# EAGLE design MainBoard (EAGLE 6.2)
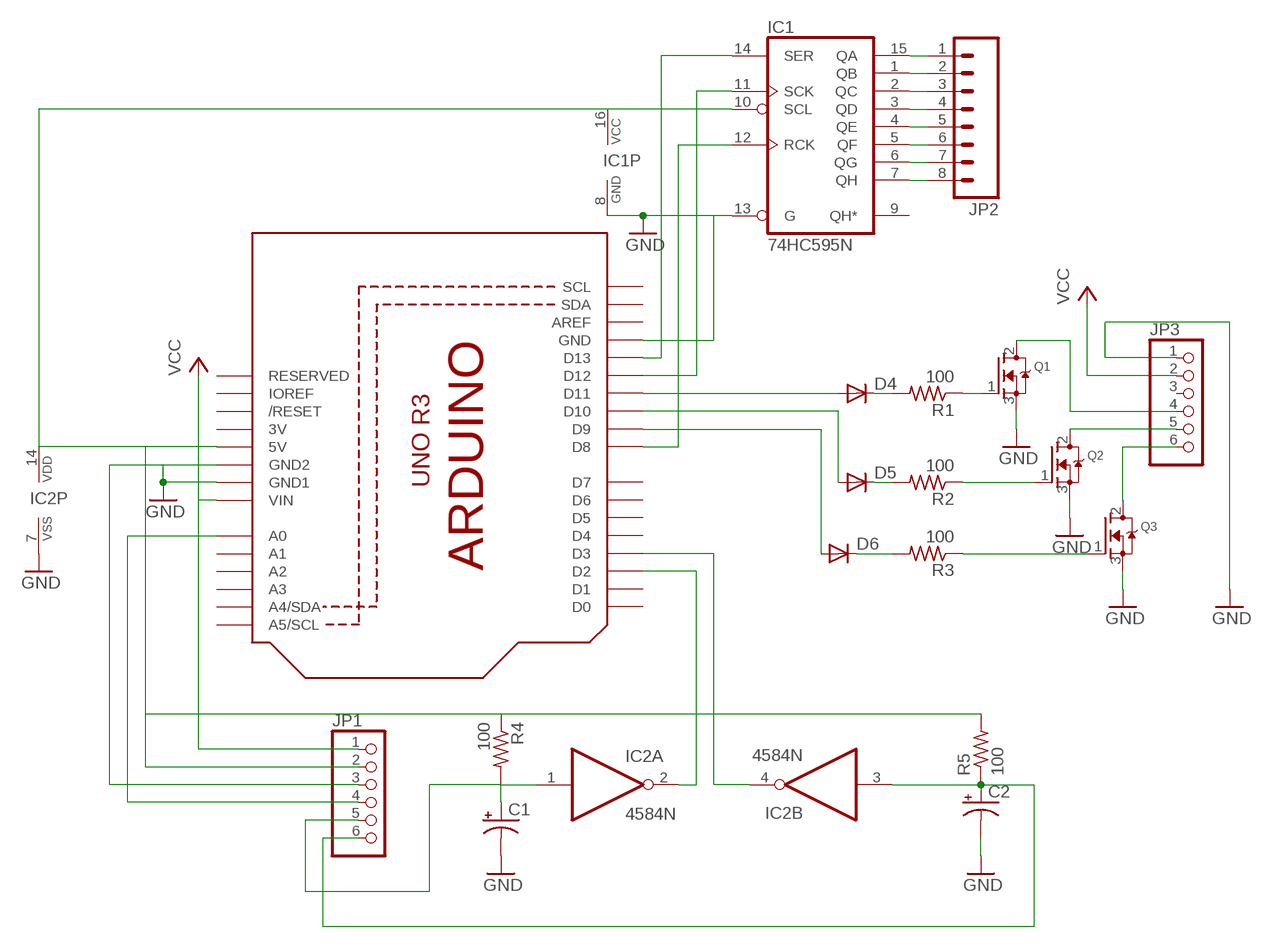
[diagram p0: schematic, sheet 1]

## Parts
C1  CPOL-USE2.5-5  [E2,5-5]
C2  CPOL-USE2.5-5  [E2,5-5]
D4  1N4148DO35-7  [DO35-7]
D5  1N4148DO35-7  [DO35-7]
D6  1N4148DO35-7  [DO35-7]
IC1  74HC595N  [DIL16]
IC2  4584N  [DIL14]
JP1  PINHD-1X6LOCK  [1X06-BIGLOCK]
JP2  M08LOCK  [1X08_LOCK]
JP3  PINHD-1X6LOCK  [1X06-BIGLOCK]
Q1  MOSFET-NGDS_TO220V  [TO220V]
Q2  MOSFET-NGDS_TO220V  [TO220V]
Q3  MOSFET-NGDS_TO220V  [TO220V]
R1  100  R-US_0207/10  [0207/10]
R2  100  R-US_0207/10  [0207/10]
R3  100  R-US_0207/10  [0207/10]
R4  100  R-US_0207/10  [0207/10]
R5  100  R-US_0207/10  [0207/10]
U1  ARDUINOR3-BPLACE  [ARDUINOR3-BPLACE]

## Nets
5V: IC1.10(SCL) IC1.16(VCC) IC2.14(P:VDD) JP1.2 R4.1 R5.2 U1.5V
12V: JP1.1 JP3.2 U1.VIN ; supply symbol labelled VCC
BLUE: JP3.6 Q3.2(D)
GND: C1.- C2.- IC1.8(GND) IC1.13(G) IC2.7(P:VSS) JP1.3 JP3.1 Q1.3(S) Q2.3(S) Q3.3(S) U1.GND U1.GND1 U1.GND2
GREEN: JP3.4 Q1.2(D)
N$1: D6.A U1.D9
N$2: D5.A U1.D10
N$3: D4.C R1.2
N$6: IC2.4(B:O) U1.D3
N$9: IC2.2(A:O) U1.D2
N$11: D5.C R2.2
N$12: D6.C R3.2
N$14: D4.A U1.D11
N$15: IC1.1(QB) JP2.2
N$16: IC1.2(QC) JP2.3
N$17: IC1.3(QD) JP2.4
N$18: IC1.4(QE) JP2.5
N$19: IC1.5(QF) JP2.6
N$20: IC1.6(QG) JP2.7
N$21: IC1.7(QH) JP2.8
N$22: IC1.15(QA) JP2.1
N$23: IC1.12(RCK) U1.D8
N$24: IC1.11(SCK) U1.D12
N$25: IC1.14(SER) U1.D13
N$26: Q3.1(G) R3.1
N$27: Q2.1(G) R2.1
N$29: Q1.1(G) R1.1
RED: JP3.5 Q2.2(D)
SPEED: JP1.4 U1.A0
SWITCH1: C1.+ IC2.1(A:I) JP1.5 R4.2
SWITCH2: C2.+ IC2.3(B:I) JP1.6 R5.1
Unconnected: IC1.9(QH*) IC2.5(C:I) IC2.6(C:O) IC2.8(D:O) IC2.9(D:I) IC2.10(E:O) IC2.11(E:I) IC2.12(F:O) IC2.13(F:I) JP3.3 U1.A1 U1.A2 U1.A3 U1.A4(A4/SDA) U1.A5(A5/SCL) U1.AREF U1.D0 U1.D1 U1.D4 U1.D5 U1.D6 U1.D7 U1.IOREF U1.RESERVED U1.RESET(/RESET) U1.SCL U1.SDA

## Power pins joined to a net without a drawn wire
3V: U1.3V

## Library data of the parts
C1 C2 = adafruit:CPOL-US: POLARIZED CAPACITOR, American symbol
D4-D6 = diode:1N4148: DIODE high speed (Philips)
IC1 = 74xx-eu:74*595: 8-bit SHIFT REGISTER, output latch
IC2 = 45xx:4584: Hex SCHMITT TRIGGER (74C14)
JP1 JP3 = adafruit:PINHD-1X6: PIN HEADER
JP2 = SparkFun:M08: Header 8 Standard 8-pin 0.1" header. Use with straight break away headers (SKU : PRT-00116), right angle break away headers (PRT-00553), swiss pins (PRT-00743), machine pins (PRT-00117), and female headers (PRT-00115).
Q1-Q3 = adafruit:MOSFET-N: N-Channel Mosfet 2N7002E - 60V 260mA SOT23 [Digikey: 2N7002ET1GOSTR-ND] - REEL BSH103 - 30V 850mA SOT23 [Digikey: 568-5013-1-ND]
R1-R5 = adafruit:R-US_: RESISTOR, American symbol
U1 = adafruit:ARDUINOR3: This is a new object for the new Arduino R3 - with extra pins that you may want to use (such as IOref, and duplicated A4/A5

## Board
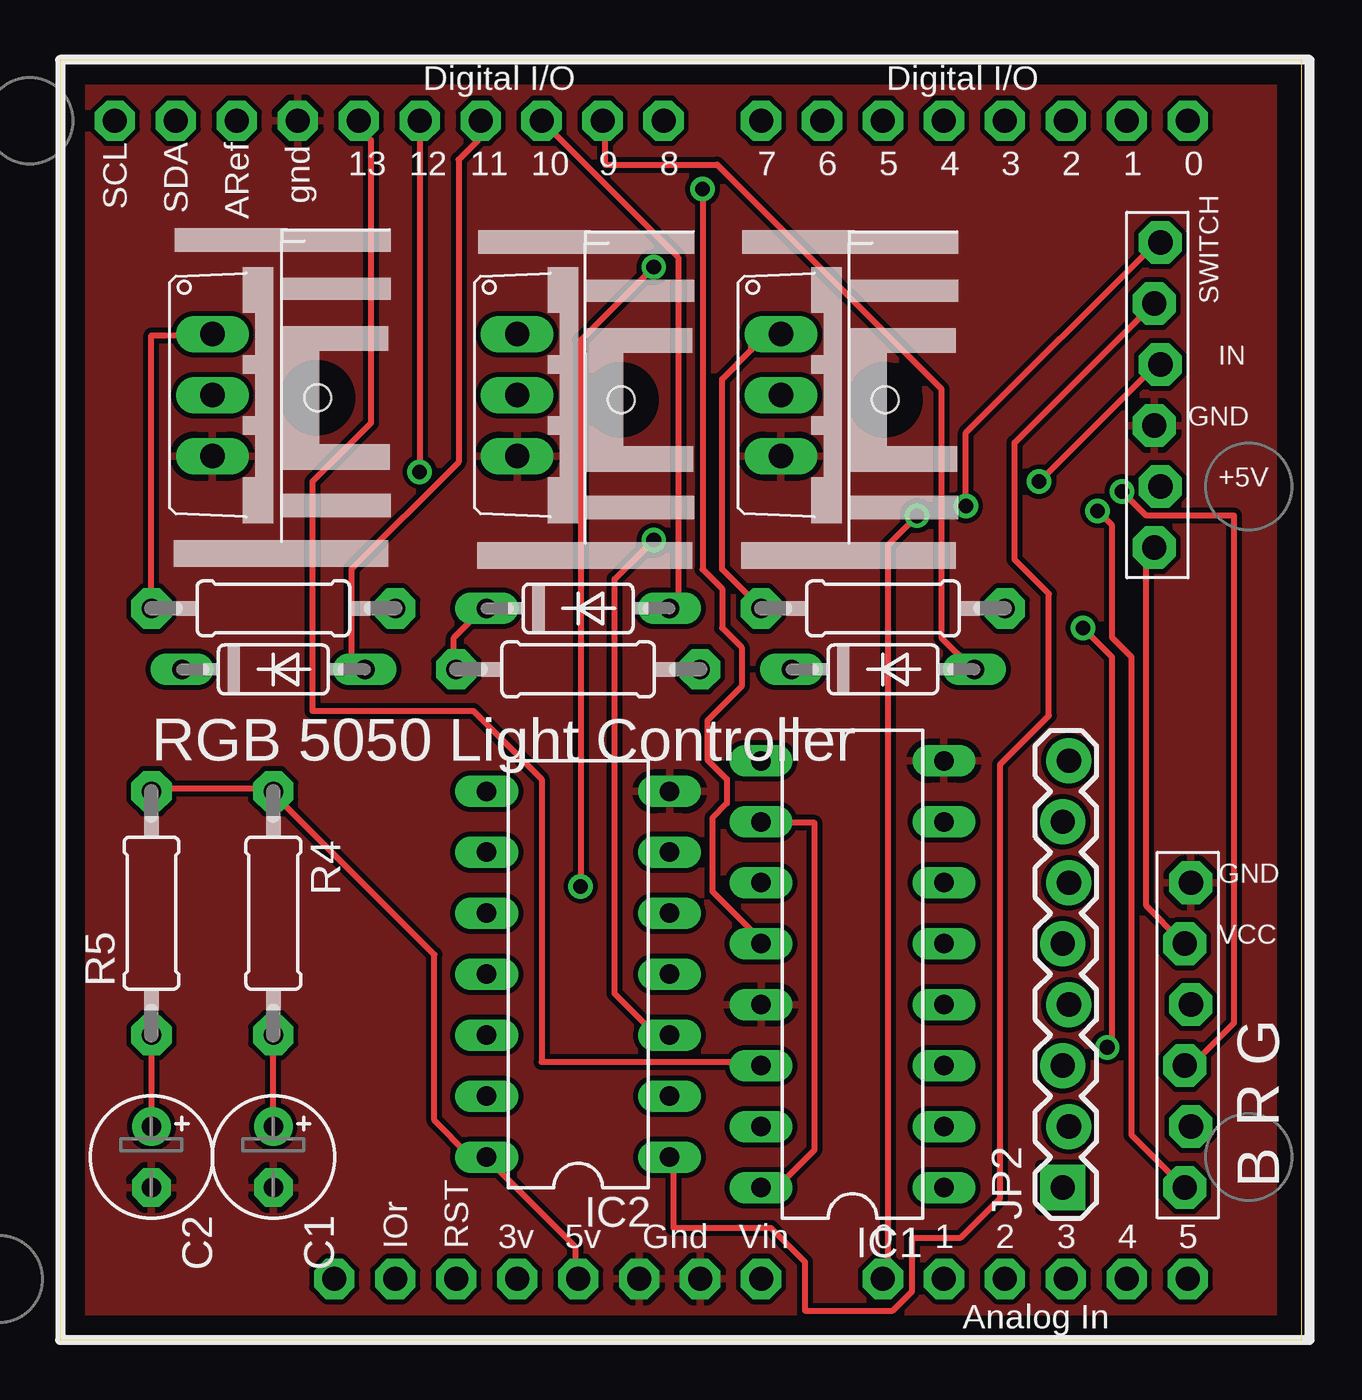
[diagram p1: board, top side]
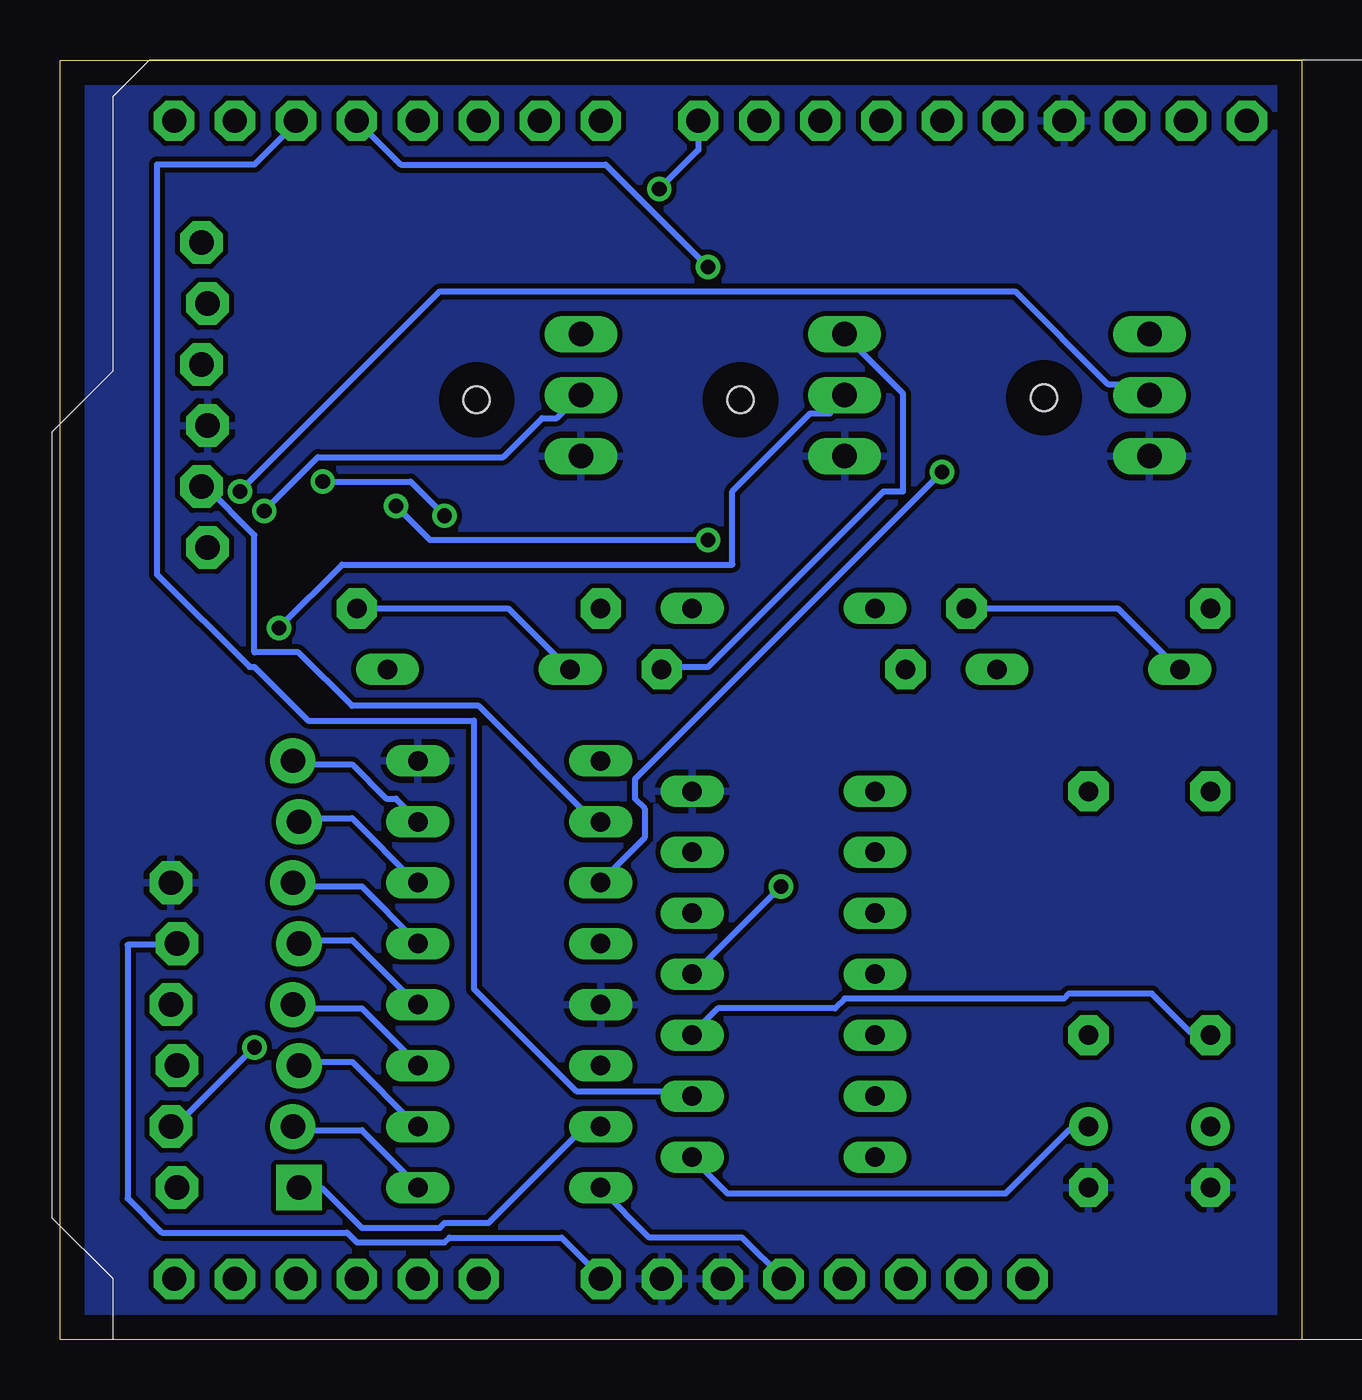
[diagram p2: board, bottom side, seen from below]

Size 51.74 x 53.33 mm. Coordinates in mm from the lower left corner, seen from the top.
Outline: 0,0 51.74,0 51.74,53.33 0,53.33 0,0
Copper layers (1*16): Top 0.035mm / dielectric 1.5mm / Bottom 0.035mm
Design rules: minimum track width 10mil, minimum drill 24mil, track to track 8mil, track to pad 8mil, pad to pad 8mil, via to via 8mil, smd to smd 8mil, copper to edge 40mil, drill to drill 8mil, minimum pad ring 10mil, minimum via ring 8mil, stop-mask expansion 4mil, vias tented up to drill 0mil, thermal gap 10mil

### Footprints (pad centres in the part's own frame; a part is rotated, then mirrored left to right if it is on the bottom)
E2,5-5 = drill 0.813 pad 1.6: + -1.27,0 | drill 0.813 pad 1.6 octagon: - 1.27,0
DO35-7 = drill 0.813 long: A 3.81,0; C -3.81,0
DIL16 = drill 0.813 long: 1 -8.89,-3.81; 2 -6.35,-3.81; 3 -3.81,-3.81; 4 -1.27,-3.81; 5 1.27,-3.81; 6 3.81,-3.81; 7 6.35,-3.81; 8 8.89,-3.81; 9 8.89,3.81; 10 6.35,3.81; 11 3.81,3.81; 12 1.27,3.81; 13 -1.27,3.81; 14 -3.81,3.81; 15 -6.35,3.81; 16 -8.89,3.81
DIL14 = drill 0.813 long: 1 -7.62,-3.81; 2 -5.08,-3.81; 3 -2.54,-3.81; 4 0,-3.81; 5 2.54,-3.81; 6 5.08,-3.81; 7 7.62,-3.81; 8 7.62,3.81; 9 5.08,3.81; 10 2.54,3.81; 11 0,3.81; 12 -2.54,3.81; 13 -5.08,3.81; 14 -7.62,3.81
1X06-BIGLOCK = drill 1.016 pad 1.778 octagon: 1 -6.35,0.127; 2 -3.81,-0.127; 3 -1.27,0.127; 4 1.27,-0.127; 5 3.81,0.127; 6 6.35,-0.127
1X08_LOCK = drill 1.016 pad 1.88 square: 1 0,0.127 | drill 1.016 pad 1.88: 2 2.54,-0.127; 3 5.08,0.127; 4 7.62,-0.127; 5 10.16,0.127; 6 12.7,-0.127; 7 15.24,0.127; 8 17.78,-0.127
TO220V = drill 1.016 long: 1 -2.54,-2.54; 2 0,-2.54; 3 2.54,-2.54
0207/10 = drill 0.813 pad 1.676 octagon: 1 -5.08,0; 2 5.08,0
ARDUINOR3-BPLACE = drill 1 pad 1.676 octagon: 3V 35.56,2.54; 5V 38.1,2.54; A0 50.8,2.54; A1 53.34,2.54; A2 55.88,2.54; A3 58.42,2.54; A4 60.96,2.54; A5 63.5,2.54; AREF 23.876,50.8; D0 63.5,50.8; D1 60.96,50.8; D2 58.42,50.8; D3 55.88,50.8; D4 53.34,50.8; D5 50.8,50.8; D6 48.26,50.8; D7 45.72,50.8; D8 41.656,50.8; D9 39.116,50.8; D10 36.576,50.8; D11 34.036,50.8; D12 31.496,50.8; D13 28.956,50.8; GND 26.416,50.8; GND1 43.18,2.54; GND2 40.64,2.54; IOREF 30.48,2.54; RESERVED 27.94,2.54; RESET 33.02,2.54; SCL 18.796,50.8; SDA 21.336,50.8; VIN 45.72,2.54
HEATSINK = hole 1.1: 7,6

### Placement (x,y rotation side)
C1  8.89,7.62 270 top
C2  3.81,7.62 270 top
D4  8.89,27.94 0 top
D5  21.59,30.48 0 top
D6  34.29,27.94 0 top
IC1  33.02,15.24 90 top
IC2  21.59,15.24 90 top
JP1  45.72,39.37 90 top
JP2  41.91,6.35 90 top
JP3  46.99,12.7 270 top
Q1  8.89,39.37 270 top
Q2  21.59,39.37 270 top
Q3  32.58,39.37 270 top
R1  8.89,30.48 0 top
R2  21.59,27.94 180 top
R3  34.29,30.48 0 top
R4  8.89,17.78 270 top
R5  3.81,17.78 90 top
U1  -16.51,0 0 top
U$1  [HEATSINK]  4.74,46.26 270 top
U$2  [HEATSINK]  17.39,46.18 270 top
U$3  [HEATSINK]  28.38,46.18 270 top

### Tracks (layer width: path | path; a pad name or v marks a point on that pad's centre or on a via)
5V
  Top 0.254: R5.2 3.81,22.96 8.89,22.96 R4.1 8.89,22.76 15.6,16.05 15.6,9.14 17.02,7.72 17.63,7.72 IC2.14 17.83,7.52 21.49,3.86 21.49,2.64 U1.5V | IC1.10 29.21,21.54 31.44,21.54 31.44,7.92 30.02,6.5 29.21,6.5 IC1.16
  Bottom 0.254: U1.5V 23.32,4.27 27.18,4.27 29.21,6.3 IC1.16 | JP1.2 45.67,35.56 43.64,33.53 43.64,28.65 41.81,28.65 39.57,26.42 34.29,26.42 29.62,21.74 29.21,21.74 IC1.10
12V
  Top 0.254: JP1.1 45.47,32.92 45.26,32.72 45.26,18.09 46.69,16.66 JP3.2
  Bottom 0.254: U1.VIN 29.21,2.64 30.84,4.27 35.51,4.27 35.71,4.06 39.37,4.06 39.78,4.47 47.5,4.47 48.92,5.89 48.92,16.46 46.89,16.46 JP3.2
BLUE  (via drill 0.61)
  Top 0.254: v43.23,34.54 43.84,33.93 43.84,29.26 44.65,28.45 44.65,8.53 46.69,6.5 JP3.6
  Bottom 0.254: v43.23,34.54 41,36.78 33.27,36.78 31.65,38.41 31.04,38.41 30.23,39.22 Q3.2
GND
  pour Bottom: 0,53.34 52.07,53.34 52.07,0 0,0
  pour Top: 0,53.34 52.07,53.34 52.07,0 0,0
GREEN  (via drill 0.61)
  Top 0.254: v44.25,35.36 45.26,34.34 48.92,34.34 48.92,13.21 47.3,11.58 46.89,11.58 JP3.4
  Bottom 0.254: v44.25,35.36 35.92,43.69 11.94,43.69 8.08,39.83 6.86,39.83 6.45,39.42 Q1.2
N$1
  Top 0.254: D6.A 37.95,28.04 36.73,29.26 36.73,39.62 27.38,48.97 22.71,48.97 22.71,50.8 U1.D9
N$2
  Top 0.254: U1.D10 25.76,45.11 25.76,30.68 25.55,30.48 D5.A
N$3
  Bottom 0.254: R1.2 7.67,30.48 5.23,28.04 D4.C
N$6  (via drill 0.61)
  Top 0.254: v21.69,18.9 21.69,41.66 v24.74,44.7
  Bottom 0.254: v21.69,18.9 25.35,15.24 IC2.4 | v24.74,44.7 29.01,48.97 37.54,48.97 U1.D3
N$9
  Bottom 0.254: IC2.2 25.55,10.16 25.76,10.36 30.23,10.36 34.49,14.63 34.49,25.81 41.4,25.81 43.64,28.04 43.84,28.04 47.7,31.9 47.7,48.97 43.64,48.97 41.81,50.8 U1.D2
N$11
  Top 0.254: D5.C 17.63,30.48 16.41,29.26 16.41,28.04 R2.2
N$12
  Bottom 0.254: R3.2 33.07,30.48 30.63,28.04 D6.C
N$14
  Top 0.254: D4.A 12.55,28.04 12.14,28.45 12.14,32.11 16.61,36.58 16.61,49.17 17.42,49.99 17.42,50.8 U1.D11
N$15
  Bottom 0.254: IC1.1 36.93,6.5 39.17,8.74 42.01,8.74 JP2.2
N$16
  Bottom 0.254: IC1.2 36.93,8.94 39.57,11.58 41.61,11.58 JP2.3
N$17
  Bottom 0.254: IC1.3 36.93,11.58 39.17,13.82 42.01,13.82 JP2.4
N$18
  Bottom 0.254: IC1.4 36.93,14.02 39.57,16.66 41.61,16.66 JP2.5
N$19
  Bottom 0.254: IC1.5 36.93,16.66 39.17,18.9 42.01,18.9 JP2.6
N$20
  Bottom 0.254: IC1.6 36.93,19.1 39.57,21.74 41.61,21.74 JP2.7
N$21
  Bottom 0.254: IC1.7 36.93,21.74 37.74,22.55 38.15,22.55 39.57,23.98 42.01,23.98 JP2.8
N$22
  Bottom 0.254: IC1.15 29.21,8.74 29.41,8.53 30.23,8.53 33.88,4.88 35.71,4.88 35.92,4.67 39.17,4.67 40.79,6.3 41.61,6.3 JP2.1
N$23  (via drill 0.61)
  Top 0.254: v26.77,47.95 26.77,32.11 27.58,31.29 27.58,29.67 28.4,28.85 28.4,27.23 26.97,25.81 26.97,24.18 27.79,23.37 27.79,22.35 27.18,21.74 27.18,18.69 29.21,16.66 IC1.12
  Bottom 0.254: v26.77,47.95 25.15,49.58 U1.D8
N$24  (via drill 0.61)
  Top 0.254: U1.D12 v14.99,36.17
  Bottom 0.254: v14.99,36.17 27.79,23.37 27.79,22.55 27.38,22.15 27.38,20.93 29.21,19.1 IC1.11
N$25
  Top 0.254: IC1.14 29.21,11.58 20.07,11.58 20.07,23.37 17.22,26.21 10.52,26.21 10.52,35.76 12.95,38.2 12.95,49.99 12.55,50.39 12.55,50.8 U1.D13
N$26
  Top 0.254: R3.1 27.58,32.11 27.58,40.03 28.8,41.25 28.8,41.86 30.02,41.86 Q3.1
N$27
  Bottom 0.254: Q2.1 19.05,41.86 16.61,39.42 16.61,35.36 17.42,35.36 24.74,28.04 26.57,28.04 R2.1
N$29
  Top 0.254: R1.1 3.81,41.86 6.25,41.86 Q1.1
RED  (via drill 0.61)
  Top 0.254: v42.62,29.67 43.84,28.45 43.84,12.39 v43.64,12.19
  Bottom 0.254: v42.62,29.67 39.98,32.31 23.72,32.31 23.72,35.36 20.47,38.61 19.66,38.61 19.05,39.22 Q2.2 | v43.64,12.19 46.89,8.94 47.09,8.94 JP3.5
SPEED  (via drill 0.61)
  Top 0.254: v35.71,34.34 34.49,33.12 34.49,2.85 34.29,2.64 U1.A0 | v40.79,35.76 45.67,40.64 JP1.4
  Bottom 0.254: v35.71,34.34 37.14,35.76 v40.79,35.76
SWITCH1
  Top 0.254: C1.+ R4.2 | JP1.5 45.47,43.08 39.78,37.39 39.78,32.51 41.2,31.09 41.2,26.01 39.17,23.98 39.17,5.89 37.54,4.27 35.51,4.27 35.51,2.03 34.7,1.22 31.04,1.22 31.04,3.25 29.62,4.67 25.55,4.67 25.55,7.52 IC2.1
  Bottom 0.254: IC2.1 25.35,7.52 23.93,6.1 12.34,6.1 9.7,8.74 8.89,8.74 C1.+
SWITCH2  (via drill 0.61)
  Top 0.254: R5.1 C2.+ | v37.74,34.75 37.74,37.8 45.67,45.72 JP1.6 | v24.74,33.33 23.11,31.7 23.11,14.43 24.74,12.8 25.35,12.8 IC2.3
  Bottom 0.254: IC2.3 25.35,12.8 24.33,13.82 19.46,13.82 19.05,14.22 9.91,14.22 9.7,14.43 6.25,14.43 4.62,12.8 3.81,12.8 R5.1 | v37.74,34.75 36.32,33.33 v24.74,33.33

### Text on the board
tNames: SWITCH | IN | GND | +5V | RGB 5050 Light Controller | GND | VCC | G | R | B